# EAGLE design miditendo_rev4 (EAGLE 6.1)
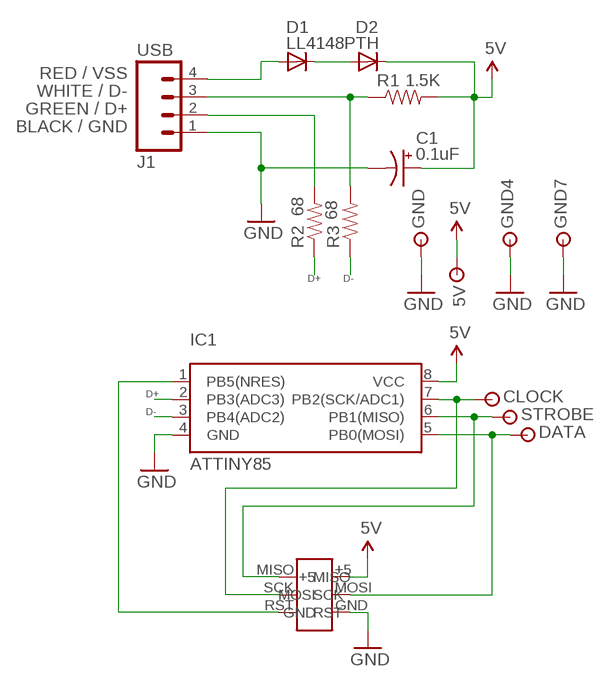
[diagram p0: schematic, sheet 1]

## Parts
5V  WIRE_JOINT  [THSOLDERPOINT]
C1  0.1uF  POLARIZEDCAPACITORTH_2.54  [POLCAP_2.54]
CLOCK  WIRE_JOINT  [THSOLDERPOINT]
D1  LL4148PTH  [1N4148-PTH]
D2  LL4148PTH  [1N4148-PTH]
DATA  WIRE_JOINT  [THSOLDERPOINT]
GND  WIRE_JOINT  [THSOLDERPOINT]
GND4  WIRE_JOINT  [THSOLDERPOINT]
GND7  WIRE_JOINT  [THSOLDERPOINT]
IC1  ATTINY85  ATTINY85DIP  [DIP8]
R1  1.5K  RESISTOR0805  [0805]
R2  68  RESISTOR0805  [0805]
R3  68  RESISTOR0805  [0805]
STROBE  WIRE_JOINT  [THSOLDERPOINT]
U$1  ICSPSMD  [ICSP_SMD]
USB  J1  M04SMD  [1X04-SMD]

## Nets
5V: 5V.P$1 C1.P(+) D2.C IC1.8(VCC) R1.2 U$1.+5
D+: IC1.2(PB3(ADC3)) R2.1
D-: IC1.3(PB4(ADC2)) R3.1
GND: C1.N(-) GND4.P$1 GND7.P$1 GND.P$1 IC1.4(GND) U$1.GND USB.1
MOSI: DATA.P$1 IC1.5(PB0(MOSI)) U$1.MOSI
N$1: D1.A USB.4
N$2: D1.C D2.A
N$3: IC1.6(PB1(MISO)) STROBE.P$1 U$1.MISO
N$4: CLOCK.P$1 IC1.7(PB2(SCK/ADC1)) U$1.SCK
N$5: R2.2 USB.2
N$7: R1.1 R3.2 USB.3
N$12: IC1.1(PB5(NRES)) U$1.RST

## Notes on the sheet
- RED / VSS
- WHITE / D-
- GREEN / D+
- BLACK / GND
- D+ | D-
- D+
- D-

## Library data of the parts
5V CLOCK DATA GND GND4 GND7 STROBE = miditendo:WIRE_JOINT
C1 = miditendo:POLARIZEDCAPACITOR: POLARIZED CAPACITORPolarized Capacitor
D1 D2 = miditendo:LL4148: 4148 DIODE The xx4148 diode is a fast, standard small signal silicon diode with high conductance used in signal processing. The 1N4148 variant is generally available in a DO-35 glass package and is very useful at high frequencies with a reverse recovery time of no more than 4ns. This permits rectification and detection of radio frequency signals very effectively, as long as their amplitude is above the forward conduction threshold of silicon (around 0.7V) or the diode is biased.
IC1 = miditendo:ATTINY85: ATTINY85 The ATtiny85 is a low-power CMOS 8-bit microcontroller based on the AVR enhanced RISC architecture. By executing powerful instructions in a single clock cycle, the ATtiny85 achieves throughputs approaching 1 MIPS per MHz allowing the system designer to optimize power consumption versus processing speed -8K Bytes of In-System Programmable Program Memory Flash -512 Bytes In-System Programmable EEPROM -512 Bytes Internal SRAM
R1-R3 = miditendo:RESISTOR: RESISTOR
U$1 = miditendo:ICSP
USB = SparkFun:M04: Header 4 Standard 4-pin 0.1" header. Use with straight break away headers (SKU : PRT-00116), right angle break away headers (PRT-00553), swiss pins (PRT-00743), machine pins (PRT-00117), and female headers (PRT-00115). Molex polarized connector foot print use with SKU : PRT-08231 with associated crimp pins and housings. 1MM SMD Version SKU: PRT-10208

## Board
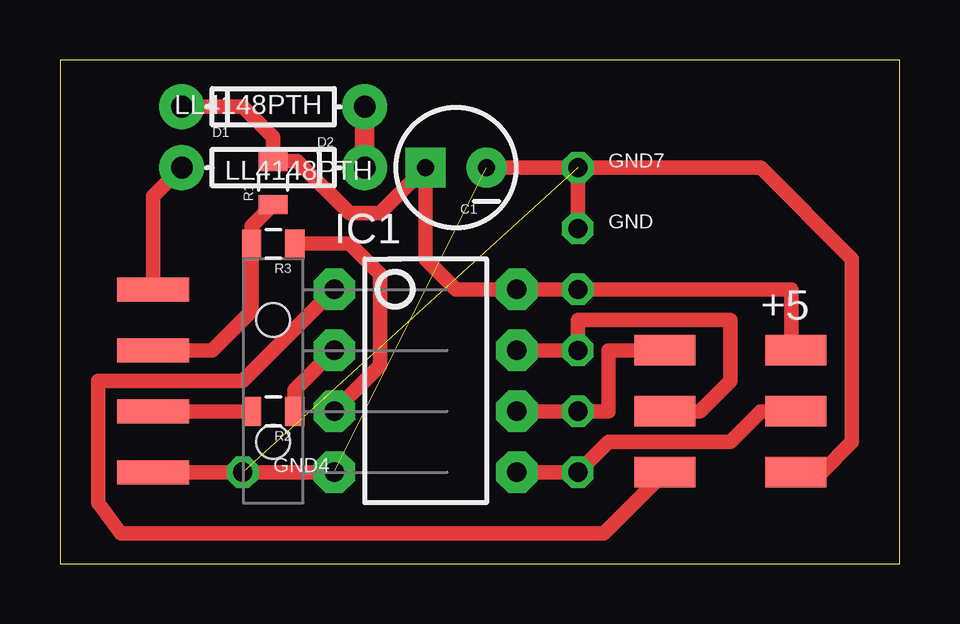
[diagram p1: board, top side]

Size 35 x 21 mm. Coordinates in mm from the lower left corner, seen from the top.
Outline: 0,0 35,0 35,21 0,21 0,0
Copper layers (1*16): Top 0.035mm / dielectric 1.5mm / Bottom 0.035mm
Design rules: minimum track width 10mil, minimum drill 24mil, track to track 0.3mm, track to pad 0.3mm, pad to pad 0.3mm, via to via 0.3mm, smd to smd 0.3mm, copper to edge 0.3mm, drill to drill 0.3mm, minimum pad ring 10mil, minimum via ring 8mil, stop-mask expansion 4mil, vias tented up to drill 0mil, thermal gap 10mil

### Footprints (pad centres in the part's own frame; a part is rotated, then mirrored left to right if it is on the bottom)
THSOLDERPOINT = drill 0.8 octagon: P$1 0,0
POLCAP_2.54 = drill 0.7 pad 1.651: N -1.27,0 | drill 0.7 pad 1.651 square: P 1.27,0
1N4148-PTH = drill 0.9 pad 1.88: A -3.81,0; C 3.81,0
DIP8 = drill 0.813 pad 1.727 octagon: 1 -3.81,-3.81; 2 -1.27,-3.81; 3 1.27,-3.81; 4 3.81,-3.81; 5 3.81,3.81; 6 1.27,3.81; 7 -1.27,3.81; 8 -3.81,3.81
0805 = smd 0.8 x 1.2: 1 -0.9,0; 2 0.9,0
ICSP_SMD = smd 2.54 x 1.27: +5 2.73,2.54; GND 2.73,-2.54; MISO -2.73,2.54; MOSI 2.73,0; RST -2.73,-2.54; SCK -2.73,0
1X04-SMD = smd 1 x 3: 1 -3.81,5; 2 -1.27,5; 3 1.27,5; 4 3.81,5 | hole 1.4: -2.54,0; 2.54,0

### Placement (x,y rotation side)
5V  21.59,11.43 0 bottom
C1  16.51,16.51 180 top
CLOCK  21.59,8.89 0 bottom
D1  8.89,16.51 0 top
D2  8.89,19.05 180 top
DATA  21.59,3.81 0 bottom
GND  21.59,13.97 0 top
GND4  7.62,3.81 0 top
GND7  21.59,16.51 0 top
IC1  15.24,7.62 270 top
R1  8.89,15.88 90 top
R2  8.89,6.35 180 top
R3  8.89,13.34 180 top
STROBE  21.59,6.35 0 bottom
U$1  27.94,6.35 0 top
USB  8.89,7.62 90 top

### Tracks (layer width: path | path; a pad name or v marks a point on that pad's centre or on a via)
5V
  Top 0.61: D2.C 7.62,19.05 8.89,17.78 R1.2 9.89,16.77 12.06,14.61 13.34,14.61 C1.P 15.24,12.7 16.51,11.43 IC1.8 5V.P$1 30.48,11.43 30.48,8.89
  Top 0.813: U$1.+5 30.48,8.89
D+
  Top 0.61: R2.1 9.79,7.25 IC1.2
D-
  Top 0.61: IC1.3 13.34,8.26 13.34,12.06 12.06,13.34 R3.1
GND  (2 unrouted)
  Top 0.61: IC1.4 GND4.P$1 USB.1 | C1.N GND7.P$1 | GND7.P$1 29.21,16.51 33.02,12.7 33.02,5.08 31.75,3.81 U$1.GND | GND.P$1 GND7.P$1
  Top 0.813: U$1.GND 30.48,3.81
MOSI
  Top 0.61: IC1.5 DATA.P$1 22.86,5.08 27.94,5.08 29.21,6.35 U$1.MOSI
N$1
  Top 0.61: USB.4 3.89,15.32 D1.A
N$2
  Top 0.813: D2.A D1.C
N$3
  Top 0.61: STROBE.P$1 IC1.6 22.86,6.35 22.86,8.89 U$1.MISO
N$4
  Top 0.61: IC1.7 CLOCK.P$1 21.59,10.16 27.94,10.16 27.94,7.62 26.67,6.35 U$1.SCK
N$5
  Top 0.61: R2.2 USB.2
N$7
  Top 0.61: USB.3 6.35,8.89 7.99,10.53 R3.2 7.99,14.07 R1.1
N$12
  Top 0.61: IC1.1 7.62,7.62 1.59,7.62 1.59,2.54 2.54,1.27 22.67,1.27 U$1.RST